# Altium schematic sheet FPGA_165B_DAC.SchDoc
size B; Organization: Altium Limited; Address1: L3, 12a Rodborough Rd; Address2: Frenchs Forest; Address3: NSW; Address4: Australia 2086; DocumentNumber: 1; SheetNumber: 1; SheetTotal: 3
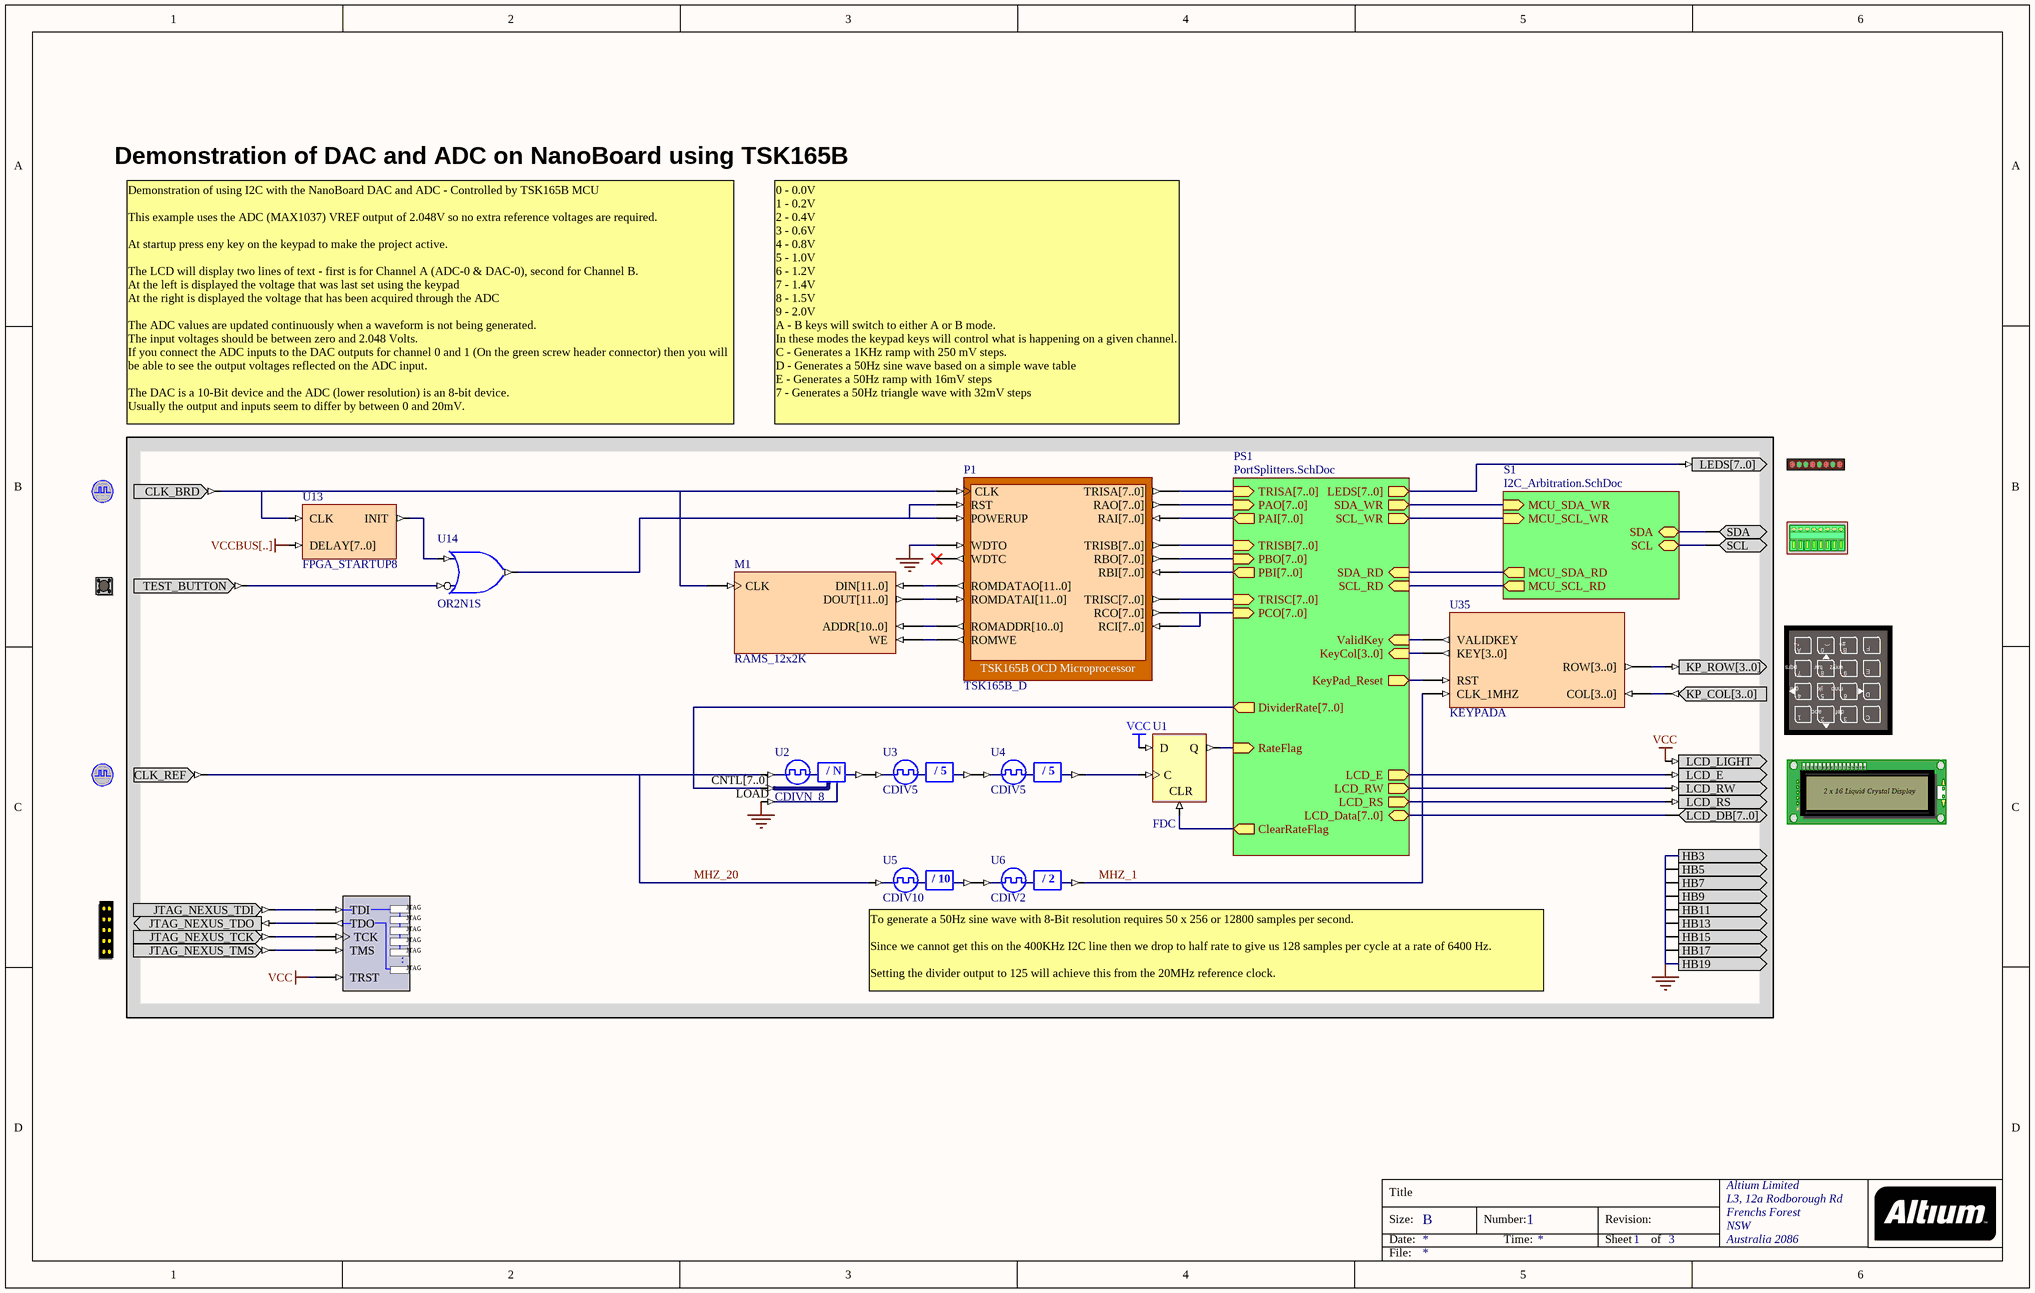
[diagram p0: FPGA_165B_DAC.SchDoc]

## Parts
(Parts that share a designator on the sheet are numbered #1, #2 ... from top to bottom, then left to right.)
?#1  LED  (value not drawn)
?#2  CLOCK_BOARD  (value not drawn)
?#3  ADCDAC_I2C  (value not drawn)
?#4  TEST_BUTTON  (value not drawn)
?#5  KEYPAD  (value not drawn)
?#6  LCD  (value not drawn)
?#7  CLOCK_REFERENCE  (value not drawn)
?#8  NEXUS_JTAG_CONNECTOR  (value not drawn)
M1  RAMS_12x2K
NEXUS_JTAG_PORT  NEXUS_JTAG_PORT  (value not drawn)
P1  TSK165B_D
U1  FDC
U2  CDIVN_8
U3  CDIV5
U4  CDIV5
U5  CDIV10
U6  CDIV2
U13  FPGA_STARTUP8
U14  OR2N1S
U35  KEYPADA

## Sub-sheets
PS1 = PortSplitters.SchDoc: SDA_RD (in), RateFlag (in), SCL_RD (in), ValidKey (in), SDA_WR (out), SCL_WR (out), ClearRateFlag (out), PCO[7..0] (in), PBI[7..0] (out), PAI[7..0] (out), PAO[7..0] (in), PBO[7..0] (in), KeyCol[3..0] (in), KeyPad_Reset (out), TRISA[7..0] (in), LCD_Data[7..0] (bidir), TRISB[7..0] (in), LEDS[7..0] (out), LCD_E (out), LCD_RW (out), LCD_RS (out), TRISC[7..0] (in), DividerRate[7..0] (out)
S1 = I2C_Arbitration.SchDoc: SDA (bidir), SCL (bidir), MCU_SCL_RD (out), MCU_SDA_WR (in), MCU_SCL_WR (in), MCU_SDA_RD (out)

## Ports
HB3 (out), HB5 (out), HB7 (out), HB9 (out), HB11 (out), HB13 (out), HB15 (out), HB17 (out), HB19 (out)

## Nets
GND: P1.WDTO U2.LOAD ; port HB19, port HB11, port HB9, port HB15, port HB13, port HB17, port HB7, port HB3, port HB5
VCC: ?#6.LCD_LIGHT NEXUS_JTAG_PORT.TRST U1.D
VCCBUS[..]: U13.DELAY[7..0]
MHZ_1: U6.CLKDV U35.CLK_1MHZ
MHZ_20: ?#7.CLK_REF U2.CLKIN U5.CLKIN
Net?#1_LEDS[7..0]: ?#1.LEDS[7..0] ; sheet PS1/LEDS[7..0]
Net?#2_CLK_BRD: ?#2.CLK_BRD M1.CLK P1.CLK U13.CLK
Net?#3_SCL: ?#3.SCL ; sheet S1/SCL
Net?#3_SDA: ?#3.SDA ; sheet S1/SDA
Net?#4_TEST_BUTTON: ?#4.TEST_BUTTON U14.I0
Net?#5_KP_COL[3..0]: ?#5.KP_COL[3..0] U35.COL[3..0]
Net?#5_KP_ROW[3..0]: ?#5.KP_ROW[3..0] U35.ROW[3..0]
Net?#6_LCD_DB[7..0]: ?#6.LCD_DB[7..0] ; sheet PS1/LCD_Data[7..0]
Net?#6_LCD_E: ?#6.LCD_E ; sheet PS1/LCD_E
Net?#6_LCD_RS: ?#6.LCD_RS ; sheet PS1/LCD_RS
Net?#6_LCD_RW: ?#6.LCD_RW ; sheet PS1/LCD_RW
Net?#8_JTAG_NEXUS_TCK: ?#8.JTAG_NEXUS_TCK NEXUS_JTAG_PORT.TCK
Net?#8_JTAG_NEXUS_TDI: ?#8.JTAG_NEXUS_TDI NEXUS_JTAG_PORT.TDI
Net?#8_JTAG_NEXUS_TDO: ?#8.JTAG_NEXUS_TDO NEXUS_JTAG_PORT.TDO
Net?#8_JTAG_NEXUS_TMS: ?#8.JTAG_NEXUS_TMS NEXUS_JTAG_PORT.TMS
NetM1_ADDR[10..0]: M1.ADDR[10..0] P1.ROMADDR[10..0]
NetM1_DIN[11..0]: M1.DIN[11..0] P1.ROMDATAO[11..0]
NetM1_DOUT[11..0]: M1.DOUT[11..0] P1.ROMDATAI[11..0]
NetM1_WE: M1.WE P1.ROMWE
NetP1_POWERUP: P1.POWERUP P1.RST U14.O
NetP1_RAI[7..0]: P1.RAI[7..0] ; sheet PS1/PAI[7..0]
NetP1_RAO[7..0]: P1.RAO[7..0] ; sheet PS1/PAO[7..0]
NetP1_RBI[7..0]: P1.RBI[7..0] ; sheet PS1/PBI[7..0]
NetP1_RBO[7..0]: P1.RBO[7..0] ; sheet PS1/PBO[7..0]
NetP1_RCI[7..0]: P1.RCI[7..0] P1.RCO[7..0] ; sheet PS1/PCO[7..0]
NetP1_TRISA[7..0]: P1.TRISA[7..0] ; sheet PS1/TRISA[7..0]
NetP1_TRISB[7..0]: P1.TRISB[7..0] ; sheet PS1/TRISB[7..0]
NetP1_TRISC[7..0]: P1.TRISC[7..0] ; sheet PS1/TRISC[7..0]
NetU1_C: U1.C U4.CLKDV
NetU1_CLR: U1.CLR ; sheet PS1/ClearRateFlag
NetU1_Q: U1.Q ; sheet PS1/RateFlag
NetU2_CLKDV: U2.CLKDV U3.CLKIN
NetU2_CNTL[7..0]: U2.CNTL[7..0] ; sheet PS1/DividerRate[7..0]
NetU3_CLKDV: U3.CLKDV U4.CLKIN
NetU5_CLKDV: U5.CLKDV U6.CLKIN
NetU13_INIT: U13.INIT U14.I1
NetU35_KEY[3..0]: U35.KEY[3..0] ; sheet PS1/KeyCol[3..0]
NetU35_RST: U35.RST ; sheet PS1/KeyPad_Reset
NetU35_VALIDKEY: U35.VALIDKEY ; sheet PS1/ValidKey
(unnamed): sheet S1/MCU_SCL_RD, sheet PS1/SCL_RD
(unnamed): sheet S1/MCU_SDA_WR, sheet PS1/SDA_WR
(unnamed): sheet S1/MCU_SCL_WR, sheet PS1/SCL_WR
(unnamed): sheet S1/MCU_SDA_RD, sheet PS1/SDA_RD

Not connected (* = marked no-connect by the designer): P1 WDTC*

## Notes on the sheet
- Demonstration of DAC and ADC on NanoBoard using TSK165B
- Demonstration of using I2C with the NanoBoard DAC and ADC - Controlled by TSK165B MCU
  This example uses the ADC (MAX1037) VREF output of 2.048V so no extra reference voltages are required.
  At startup press eny key on the keypad to make the project active.
  The LCD will display two lines of text - first is for Channel A (ADC-0 & DAC-0), second for Channel B.
  At the left is displayed the voltage that was last set using the keypad
  At the right is displayed the voltage that has been acquired through the ADC
  The ADC values are updated continuously when a waveform is not being generated.
  The input voltages should be between zero and 2.048 Volts.
  If you connect the ADC inputs to the DAC outputs for channel 0 and 1 (On the green screw header connector) then you will be able to see the output voltages reflected on the ADC input.
  The DAC is a 10-Bit device and the ADC (lower resolution) is an 8-bit device.
  Usually the output and inputs seem to differ by between 0 and 20mV.
- 0 - 0.0V
  1 - 0.2V
  2 - 0.4V
  3 - 0.6V
  4 - 0.8V
  5 - 1.0V
  6 - 1.2V
  7 - 1.4V
  8 - 1.5V
  9 - 2.0V
  A - B keys will switch to either A or B mode.
  In these modes the keypad keys will control what is happening on a given channel.
  C - Generates a 1KHz ramp with 250 mV steps.
  D - Generates a 50Hz sine wave based on a simple wave table
  E - Generates a 50Hz ramp with 16mV steps
  7 - Generates a 50Hz triangle wave with 32mV steps
- To generate a 50Hz sine wave with 8-Bit resolution requires 50 x 256 or 12800 samples per second.
  Since we cannot get this on the 400KHz I2C line then we drop to half rate to give us 128 samples per cycle at a rate of 6400 Hz.
  Setting the divider output to 125 will achieve this from the 20MHz reference clock.
- Title
- Size:
- Date:
- B
- Number:
- Time:
- Revision:
- Sheet
- of
- File:
- (in symbol CDIV2) / 2
- (in symbol CDIV5) / 5
- (in symbol CDIV10) / 10
- (in symbol CDIVN_8) / N
- (in symbol KEYPAD) *+; (; #^; A; 0; B; F; pqrs; tuv; wxyz; 7; 8; 9; E; ghi; jkl; mno; D; 4; 5; 6; abc; def; 1; 2; 3; C
- (in symbol LCD) 2 x 16 Liquid Crystal Display
- (in symbol NEXUS_JTAG_PORT) JTAG; .

## Library data of the parts
?#1 = LED: 8-Way LEDS; PortComponent: True; Published: 19-Nov-2003; Publisher: Altium Limited
?#2 = CLOCK_BOARD: Global System Clock Supply; PortComponent: True; Published: 19-Nov-2003; Publisher: Altium Limited
?#3 = ADCDAC_I2C: Analog Digital/ Digital Analog Converter, I2C Interface; PortComponent: True; Published: 19-Nov-2003; Publisher: Altium Limited
?#4 = TEST_BUTTON: Test Button; PortComponent: True; Published: 19-Nov-2003; Publisher: Altium Limited
?#5 = KEYPAD: Key Pad; PortComponent: True; Published: 19-Nov-2003; Publisher: Altium Limited
?#6 = LCD: Liquid Crystal Display; PortComponent: True; Published: 19-Nov-2003; Publisher: Altium Limited
?#7 = CLOCK_REFERENCE: Global System Clock Reference Supply; PortComponent: True; Published: 19-Nov-2003; Publisher: Altium Limited
?#8 = NEXUS_JTAG_CONNECTOR: JTAG Port; PortComponent: True; Published: 19-Nov-2003; Publisher: Altium Limited
M1 = RAMS_12x2K: Single Port Random Access Memory; Memory_Depth: 2048; Memory_Type: RAM_SinglePortBlock; Memory_Width: 12; Memory_ClockEdge: Rising; Nexus_Core: Memory_Program; Published: 13/01/2004; Publisher: Altium Hobart Technology Center
NEXUS_JTAG_PORT = NEXUS_JTAG_PORT: Soft Nexus-Chain Connector; NEXUS_JTAG_CONNECTOR: True; Published: 18-Dec-2003; Publisher: Altium Limited
P1 = TSK165B_D: TSK165B OCD Microprocessor; NEXUS_CORE: Processor_OCDS; NEXUS_JTAG_DEVICE: True; NEXUS_JTAG_ORDER: 0; ChildModel1: TSK165B_D_RAM128x8; ChildCore1: M1; Published: 1/12/2003; Publisher: Altium Hobart Technology Centre; Core Revision: 1.00.00
U1 = FDC: D-Type Flip-Flop with Asynchronous Clear; ArchiveName: GENERIC; Published: 18-Dec-2003; Publisher: Altium Limited; Xilinx Equivalent: FDC; Core Revision: 1.00.00
U2 = CDIVN_8: 8-Bit Programmable Clock Divider; ArchiveName: GENERIC; Published: 18-Nov-2003; Publisher: Altium Limited; Core Revision: 1.00.00
U3 U4 = CDIV5: Clock Divider by 5; ArchiveName: GENERIC; Published: 18-Nov-2003; Publisher: Altium Limited; Core Revision: 1.00.00
U5 = CDIV10: Clock Divider by 10; ArchiveName: GENERIC; Published: 18-Nov-2003; Publisher: Altium Limited; Core Revision: 1.00.00
U6 = CDIV2: Clock Divider by 2; ArchiveName: GENERIC; Published: 18-Nov-2003; Publisher: Altium Limited; Core Revision: 1.00.00
U13 = FPGA_STARTUP8: FPGA Startup With 8 Bit Delay; Published: 21/01/2004; Publisher: Altium Hobart Technology Centre; Core Revision: 1.00.00
U14 = OR2N1S: 2-Input OR Gate with Active Low A Input, Single Pin Version; Xilinx Equivalent: OR2B1; ArchiveName: GENERIC; Published: 18-Dec-2003; Publisher: Altium Limited; Core Revision: 1.00.00
U35 = KEYPADA: Keypad; Published: 2/01/2004; Publisher: Altium Hobart Technology Centre; Core Revision: 1.00.00